# Altium schematic sheet Arduino_Schematic.SchDoc
size A4; SheetNumber: 1; SheetTotal: 1
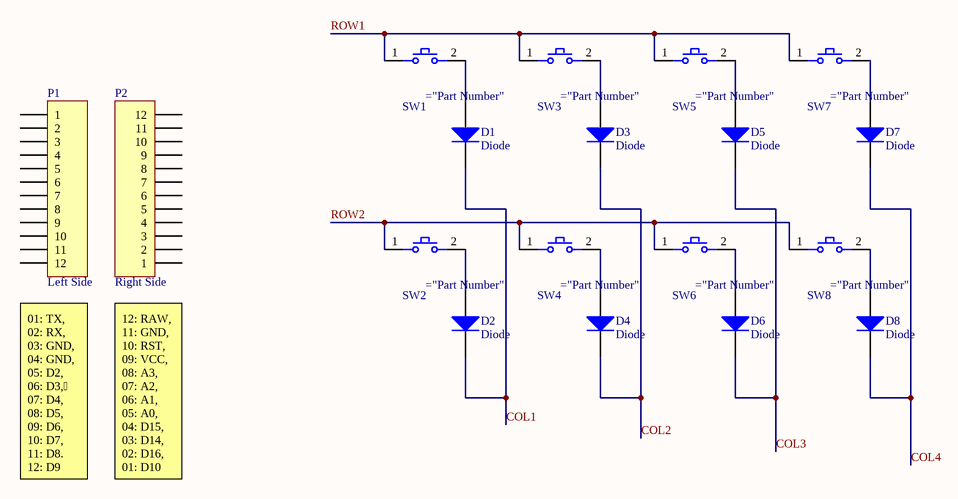
[diagram p0: Arduino_Schematic.SchDoc]

## Parts
D1  Diode  [SMC]
D2  Diode  [SMC]
D3  Diode  [SMC]
D4  Diode  [SMC]
D5  Diode  [SMC]
D6  Diode  [SMC]
D7  Diode  [SMC]
D8  Diode  [SMC]
P1  Left Side  [HDR1X12]
P2  Right Side  [HDR1X12]
SW1  MX1A-C1NW  (value not drawn)
SW2  MX1A-C1NW  (value not drawn)
SW3  MX1A-C1NW  (value not drawn)
SW4  MX1A-C1NW  (value not drawn)
SW5  MX1A-C1NW  (value not drawn)
SW6  MX1A-C1NW  (value not drawn)
SW7  MX1A-C1NW  (value not drawn)
SW8  MX1A-C1NW  (value not drawn)

## Nets
COL1: D1.2(K) D2.2(K)
COL2: D3.2(K) D4.2(K)
COL3: D5.2(K) D6.2(K)
COL4: D7.2(K) D8.2(K)
ROW1: SW1.1 SW3.1 SW5.1 SW7.1
ROW2: SW2.1 SW4.1 SW6.1 SW8.1
NetD1_1: D1.1(A) SW1.2
NetD2_1: D2.1(A) SW2.2
NetD3_1: D3.1(A) SW3.2
NetD4_1: D4.1(A) SW4.2
NetD5_1: D5.1(A) SW5.2
NetD6_1: D6.1(A) SW6.2
NetD7_1: D7.1(A) SW7.2
NetD8_1: D8.1(A) SW8.2

Not connected (* = marked no-connect by the designer): P1 1 2 3 4 5 6 7 8 9 10 11 12; P2 1 2 3 4 5 6 7 8 9 10 11 12

## Notes on the sheet
- (near P1) 01: TX, 02: RX, 03: GND, 04: GND, 05: D2, 06: D3, 07: D4, 08: D5, 09: D6, 10: D7, 11: D8. 12: D9
- (near P2) 12: RAW, 11: GND, 10: RST, 09: VCC, 08: A3, 07: A2, 06: A1, 05: A0, 04: D15, 03: D14, 02: D16, 01: D10

## Library data of the parts
D1-D8 = Diode: Default Diode; Published: 8-Jun-2000; LatestRevisionDate: 17-Jul-2002; LatestRevisionNote: Re-released for DXP Platform.; PackageVersion: Sep-1996; PackageReference: SMC; Publisher: Altium Limited; PackageDescription: DO-214-AB/SMC; 2 C-Bend Leads; Body 7.9 x 5.9 mm, inc. leads (LxW); Code_JEDEC: DO-214-AB
P1 P2 = Header 12: Header, 12-Pin; LatestRevisionDate: 17-Jul-2002; LatestRevisionNote: Re-released for DXP Platform.; Publisher: Altium Limited